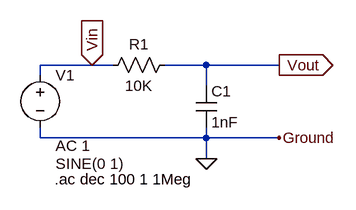
[diagram p0: schematic Filtro RC paso bajo.asc]
Filtro RC paso bajo.asc, the LTspice schematic file:
Version 4
SHEET 1 880 680
WIRE 80 112 0 112
WIRE 112 112 80 112
WIRE 256 112 192 112
WIRE 368 112 256 112
WIRE 0 128 0 112
WIRE 256 144 256 112
WIRE 0 224 0 208
WIRE 256 224 256 208
WIRE 256 224 0 224
WIRE 368 224 256 224
WIRE 256 256 256 224
FLAG 256 256 0
FLAG 368 112 Vout
IOPIN 368 112 Out
FLAG 80 112 Vin
IOPIN 80 112 In
FLAG 368 224 Ground
SYMBOL res 208 96 R90
WINDOW 0 0 56 VBottom 2
WINDOW 3 32 56 VTop 2
SYMATTR InstName R1
SYMATTR Value 10K
SYMBOL cap 240 144 R0
SYMATTR InstName C1
SYMATTR Value 1nF
SYMBOL voltage 0 112 R0
WINDOW 3 24 152 Left 2
WINDOW 123 24 124 Left 2
WINDOW 39 0 0 Left 0
SYMATTR InstName V1
SYMATTR Value SINE(0 1)
SYMATTR Value2 AC 1
TEXT 22 288 Left 2 !.ac dec 100 1 1Meg

The netlist it stands for:
* Filtro RC paso bajo.asc
R1 Vout Vin 10K
C1 Vout 0 1nF
V1 Vin 0 SINE(0 1) AC 1
.ac dec 100 1 1Meg
.backanno
.end

* Results of the author's LTspice run, read from the files saved beside the schematic
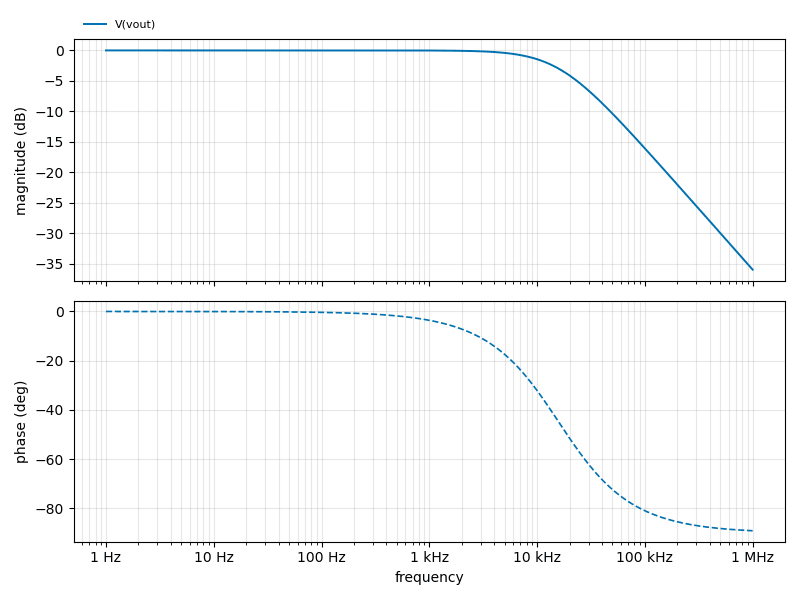
[diagram p1: AC Analysis of Filtro RC paso bajo.asc, plotted from the saved traces]
* AC Analysis, 1 run:
*   V(vout): -0.00 dB at 1 Hz, -35.96 dB at 1 MHz, peak -0.00 dB at 1 Hz, 3 dB below the peak at 15.91 kHz